# EAGLE schematic Sensors (EAGLE 9.6.2)
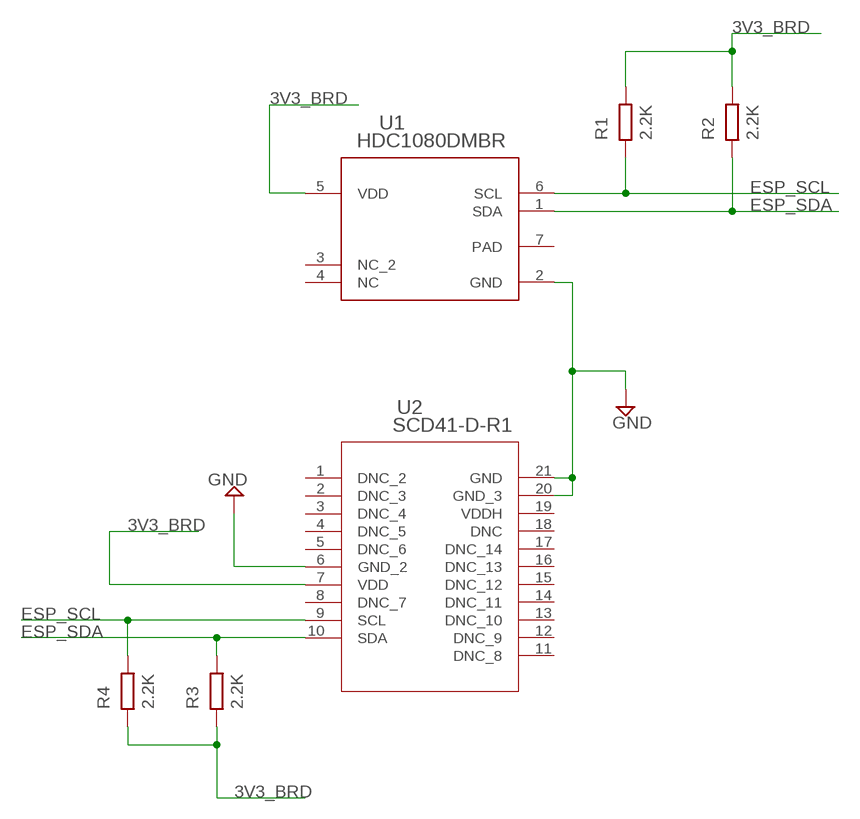
[diagram p0: schematic, sheet 1]

## Parts
R1  2.2K  R  (no package)
R2  2.2K  R  (no package)
R3  2.2K  R  (no package)
R4  2.2K  R  (no package)
U1  HDC1080DMBR  [DMB0006A]
U2  SCD41-D-R1  [SCD41-D-R1_SEN]

## Nets
3V3_BRD: R1.2 R2.2 R3.1 R4.1 U1.5(VDD) U2.7(VDD)
ESP_SCL: R1.1 R4.2 U1.6(SCL) U2.9(SCL)
ESP_SDA: R2.1 R3.2 U1.1(SDA) U2.10(SDA)
GND: U1.2(GND) U2.6(GND_2) U2.20(GND_3) U2.21(GND)
Unconnected: U1.3(NC_2) U1.4(NC) U2.1(DNC_2) U2.2(DNC_3) U2.3(DNC_4) U2.4(DNC_5) U2.5(DNC_6) U2.8(DNC_7) U2.11(DNC_8) U2.12(DNC_9) U2.13(DNC_10) U2.14(DNC_11) U2.15(DNC_12) U2.16(DNC_13) U2.17(DNC_14) U2.18(DNC)

## Power pins joined to a net without a drawn wire
PAD: U1.7(PAD)
VDDH: U2.19(VDDH)

## Library data of the parts
R1-R4 = ngspice-simulation:R: RESISTOR
U1 = Temperature_Humidity_Sensor:HDC1080DMBR: Temperature and humidity sensor that functions over I2C protocol; COPYRIGHT: Copyright (C) 2024 Ultra Librarian. All rights reserved.; MANUFACTURER_PART_NUMBER: HDC1080DMBR; MFR_NAME: Texas Instruments; REFDES: RefDes; TYPE: TYPE
U2 = SCD41:SCD41-D-R1: SCD41 is a CO2 sensor that supports I2C communication and can read 400ppm to 5000ppm; COPYRIGHT: Copyright (C) 2024 Ultra Librarian. All rights reserved.; MANUFACTURER_PART_NUMBER: SCD41-D-R1; MFR_NAME: Sensirion